# EAGLE design harp input expander (EAGLE 9.5.1)
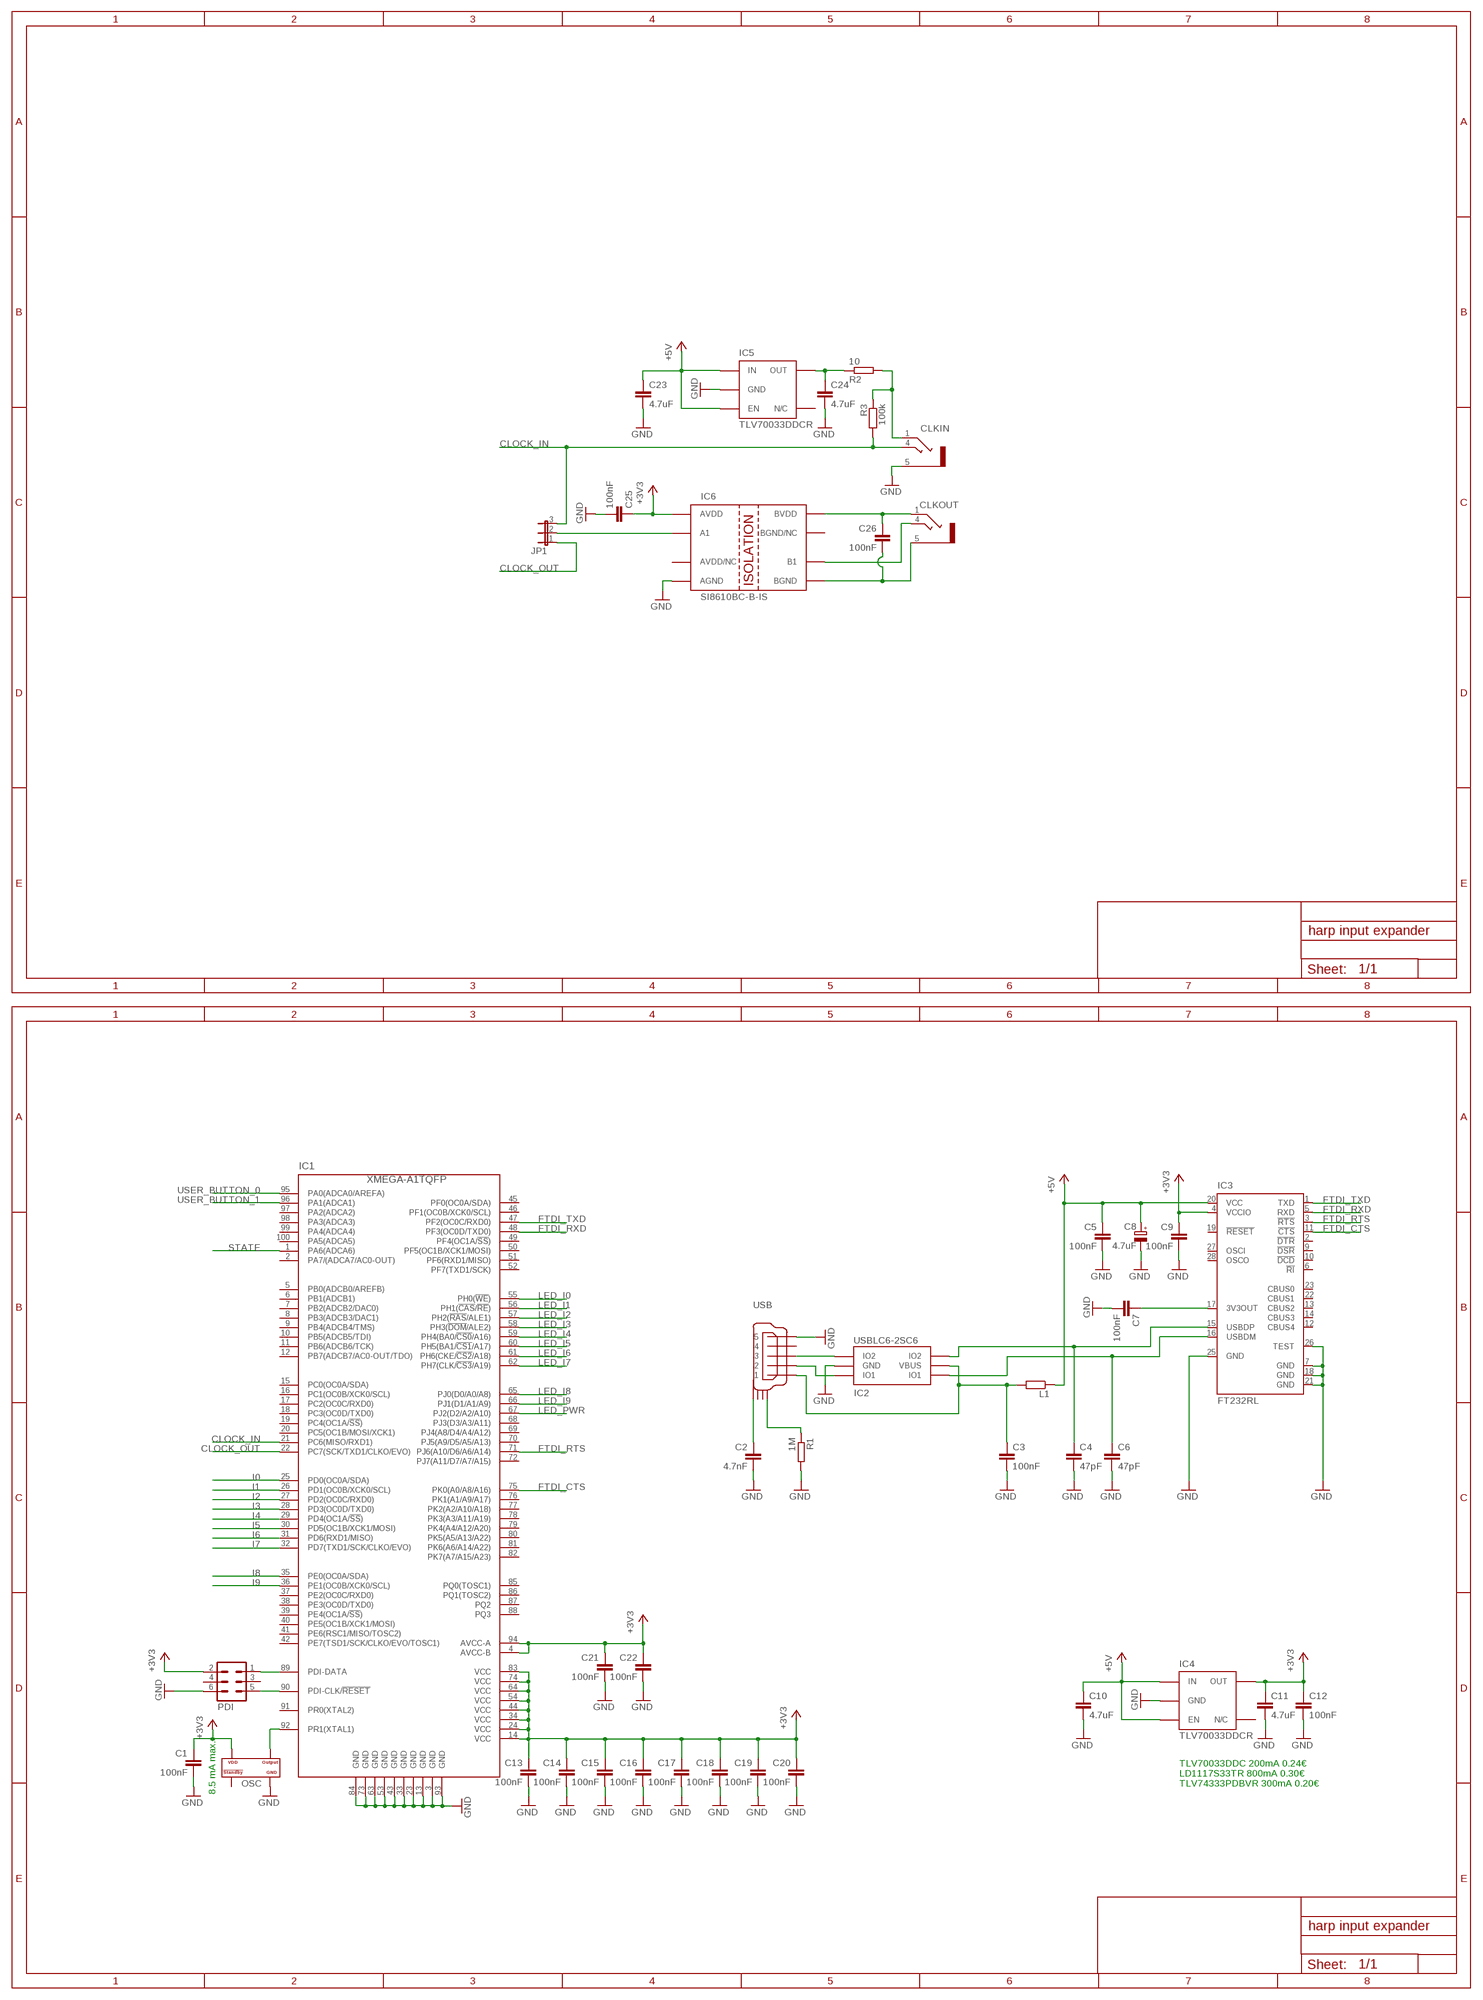
[diagram p0: schematic, sheet 1, part 1 of 2]
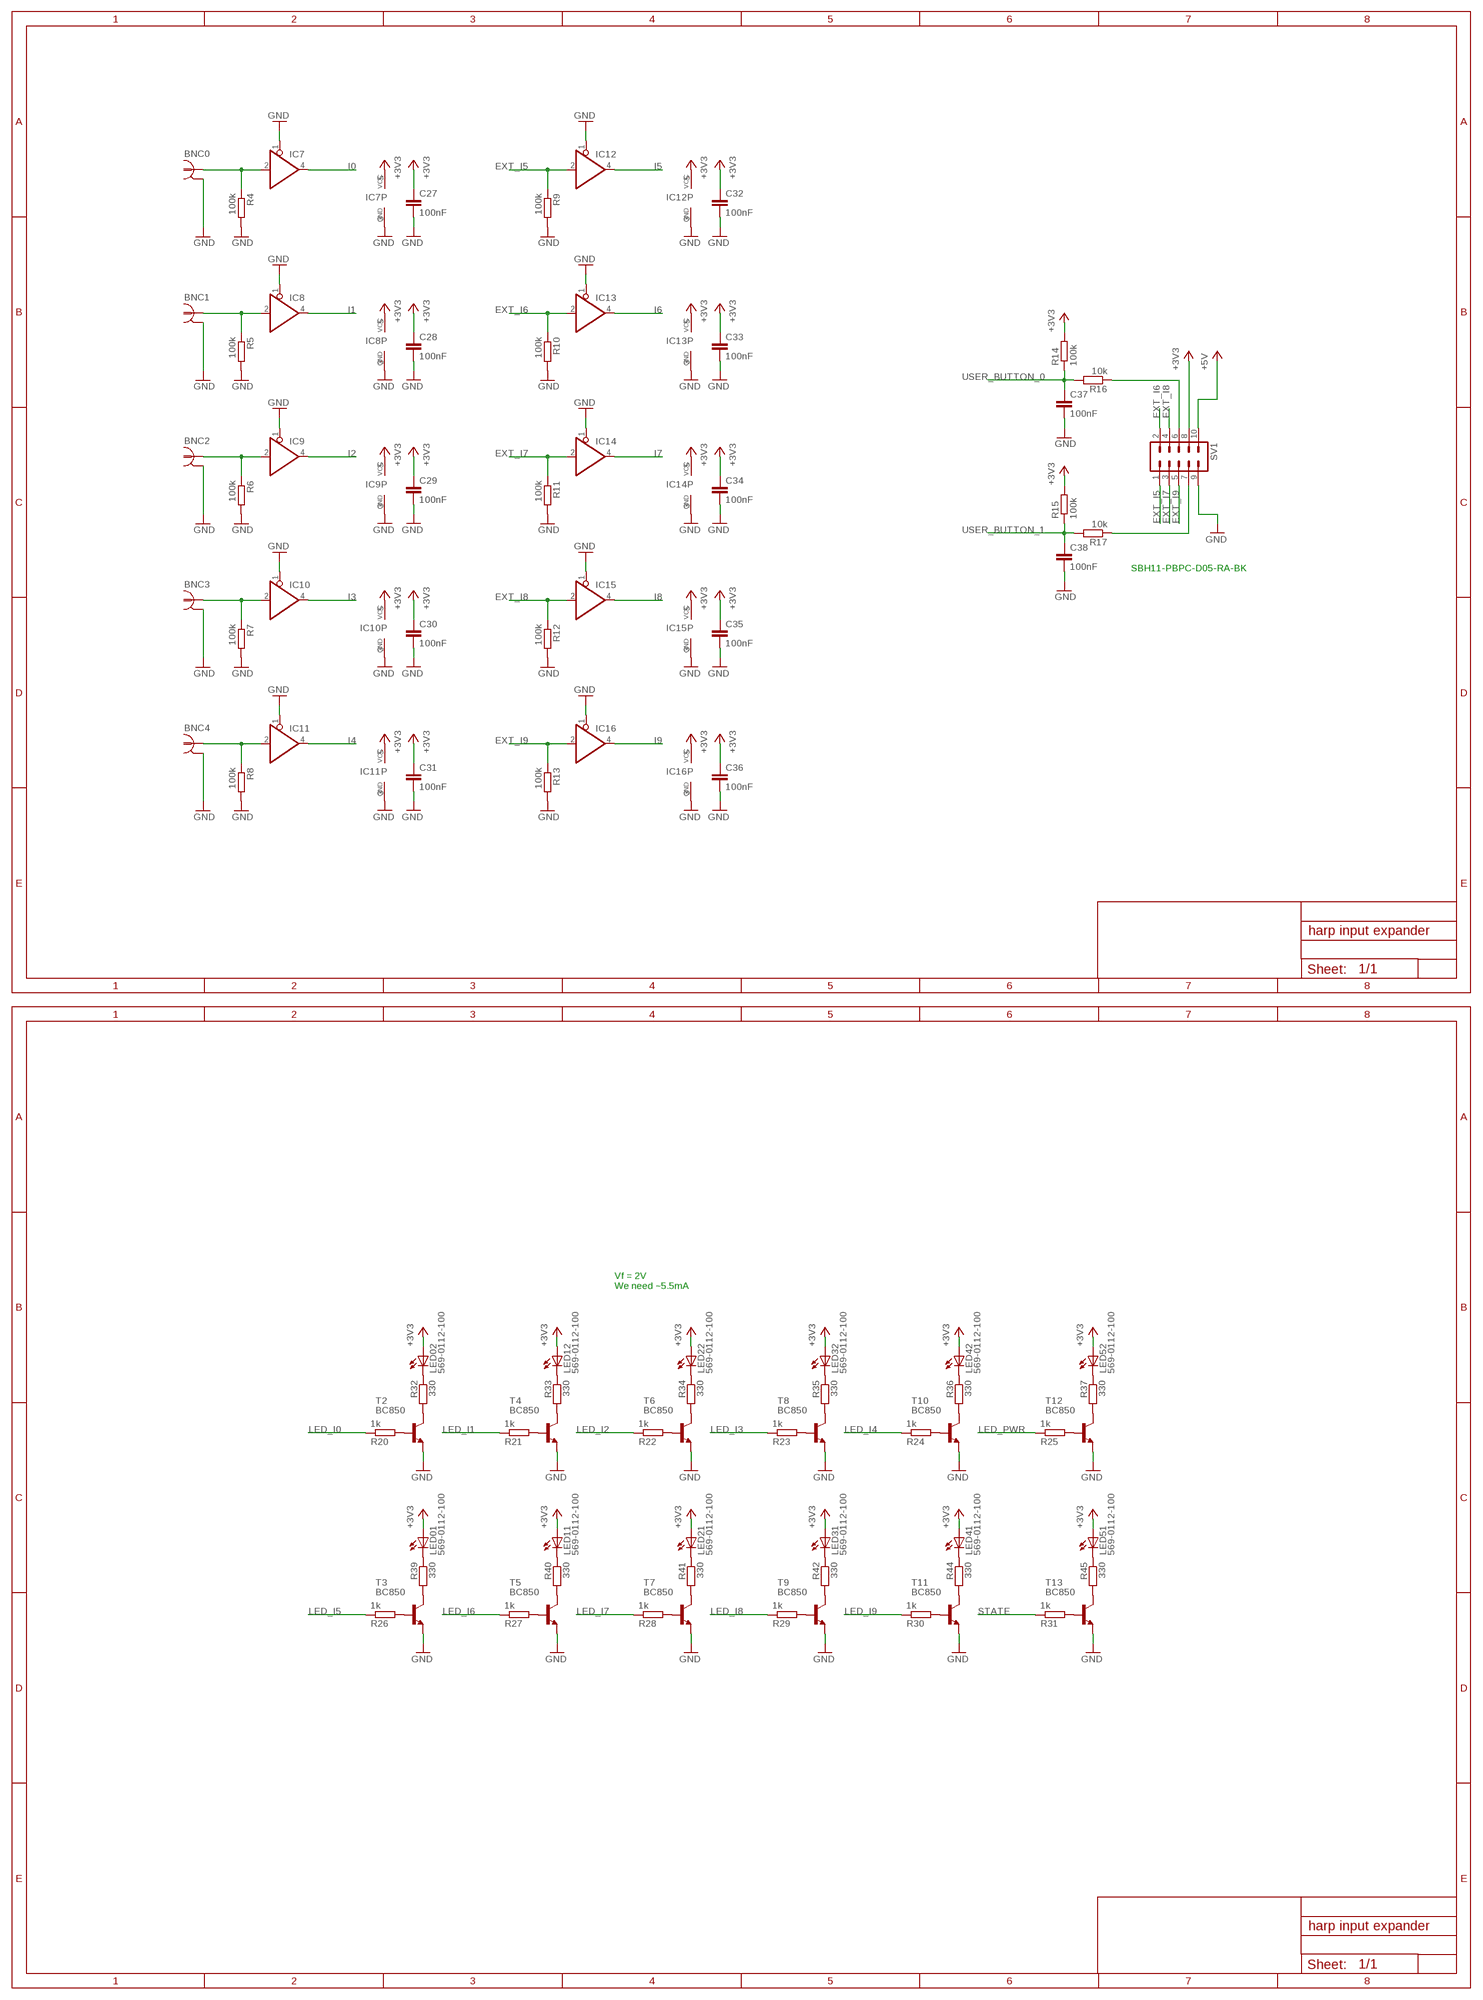
[diagram p1: schematic, sheet 1, part 2 of 2]

## Parts
BNC0  BNC_0731000105  [0731000105]
BNC1  BNC_0731000105  [0731000105]
BNC2  BNC_0731000105  [0731000105]
BNC3  BNC_0731000105  [0731000105]
BNC4  BNC_0731000105  [0731000105]
C1  100nF  C-EUC0402  [C0402]
C2  4.7nF  C-EUC0402  [C0402]
C3  100nF  C-EUC0402  [C0402]
C4  47pF  C-EUC0402  [C0402]
C5  100nF  C-EUC0402  [C0402]
C6  47pF  C-EUC0402  [C0402]
C7  100nF  C-EUC0402  [C0402]
C8  4.7uF  CPOL-EUA/3216-18W  [A/3216-18W]
C9  100nF  C-EUC0402  [C0402]
C10  4.7uF  C-EUC0603  [C0603]
C11  4.7uF  C-EUC0603  [C0603]
C12  100nF  C-EUC0402  [C0402]
C13  100nF  C-EUC0402  [C0402]
C14  100nF  C-EUC0402  [C0402]
C15  100nF  C-EUC0402  [C0402]
C16  100nF  C-EUC0402  [C0402]
C17  100nF  C-EUC0402  [C0402]
C18  100nF  C-EUC0402  [C0402]
C19  100nF  C-EUC0402  [C0402]
C20  100nF  C-EUC0402  [C0402]
C21  100nF  C-EUC0402  [C0402]
C22  100nF  C-EUC0402  [C0402]
C23  4.7uF  C-EUC0603  [C0603]
C24  4.7uF  C-EUC0603  [C0603]
C25  100nF  C-EUC0402  [C0402]
C26  100nF  C-EUC0402  [C0402]
C27  100nF  C-EUC0402  [C0402]
C28  100nF  C-EUC0402  [C0402]
C29  100nF  C-EUC0402  [C0402]
C30  100nF  C-EUC0402  [C0402]
C31  100nF  C-EUC0402  [C0402]
C32  100nF  C-EUC0402  [C0402]
C33  100nF  C-EUC0402  [C0402]
C34  100nF  C-EUC0402  [C0402]
C35  100nF  C-EUC0402  [C0402]
C36  100nF  C-EUC0402  [C0402]
C37  100nF  C-EUC0402  [C0402]
C38  100nF  C-EUC0402  [C0402]
CLKIN  STEREO_JACK  [35RASMT2BHNTRX]
CLKOUT  STEREO_JACK  [35RASMT2BHNTRX]
IC1  XMEGA-A1TQFP  [TQFP100]
IC2  USBLC6-2SC6  USBLC6-2  [SOT23-6L]
IC3  FT232RL  [SSOP28]
IC4  TLV70033DDCR  TLV700XX  [TSOT23-5]
IC5  TLV70033DDCR  TLV700XX  [TSOT23-5]
IC6  SI8610BC-B-IS  SI8610  [SO-08]
IC7  74AHC1G125DBV  [SOT23-5]
IC8  74AHC1G125DBV  [SOT23-5]
IC9  74AHC1G125DBV  [SOT23-5]
IC10  74AHC1G125DBV  [SOT23-5]
IC11  74AHC1G125DBV  [SOT23-5]
IC12  74AHC1G125DBV  [SOT23-5]
IC13  74AHC1G125DBV  [SOT23-5]
IC14  74AHC1G125DBV  [SOT23-5]
IC15  74AHC1G125DBV  [SOT23-5]
IC16  74AHC1G125DBV  [SOT23-5]
JP1  JP2E  [JP2]
L1  ???  R-EU_R0805  [R0805]
LED0  569-0112-100  LED_2X_VERTICAL  [569-011X-X00_LED_ARRAY]
LED1  569-0112-100  LED_2X_VERTICAL  [569-011X-X00_LED_ARRAY]
LED2  569-0112-100  LED_2X_VERTICAL  [569-011X-X00_LED_ARRAY]
LED3  569-0112-100  LED_2X_VERTICAL  [569-011X-X00_LED_ARRAY]
LED4  569-0112-100  LED_2X_VERTICAL  [569-011X-X00_LED_ARRAY]
LED5  569-0112-100  LED_2X_VERTICAL  [569-011X-X00_LED_ARRAY]
OSC  OSCILLATOR  [OSCILLATOR_3.2X2.5]
PDI  MA03-2  [MA03-2]
R1  1M  R-EU_R0402  [R0402]
R2  10  R-EU_R0402  [R0402]
R3  100k  R-EU_R0402  [R0402]
R4  100k  R-EU_R0402  [R0402]
R5  100k  R-EU_R0402  [R0402]
R6  100k  R-EU_R0402  [R0402]
R7  100k  R-EU_R0402  [R0402]
R8  100k  R-EU_R0402  [R0402]
R9  100k  R-EU_R0402  [R0402]
R10  100k  R-EU_R0402  [R0402]
R11  100k  R-EU_R0402  [R0402]
R12  100k  R-EU_R0402  [R0402]
R13  100k  R-EU_R0402  [R0402]
R14  100k  R-EU_R0402  [R0402]
R15  100k  R-EU_R0402  [R0402]
R16  10k  R-EU_R0402  [R0402]
R17  10k  R-EU_R0402  [R0402]
R20  1k  R-EU_R0402  [R0402]
R21  1k  R-EU_R0402  [R0402]
R22  1k  R-EU_R0402  [R0402]
R23  1k  R-EU_R0402  [R0402]
R24  1k  R-EU_R0402  [R0402]
R25  1k  R-EU_R0402  [R0402]
R26  1k  R-EU_R0402  [R0402]
R27  1k  R-EU_R0402  [R0402]
R28  1k  R-EU_R0402  [R0402]
R29  1k  R-EU_R0402  [R0402]
R30  1k  R-EU_R0402  [R0402]
R31  1k  R-EU_R0402  [R0402]
R32  330  R-EU_R0402  [R0402]
R33  330  R-EU_R0402  [R0402]
R34  330  R-EU_R0402  [R0402]
R35  330  R-EU_R0402  [R0402]
R36  330  R-EU_R0402  [R0402]
R37  330  R-EU_R0402  [R0402]
R39  330  R-EU_R0402  [R0402]
R40  330  R-EU_R0402  [R0402]
R41  330  R-EU_R0402  [R0402]
R42  330  R-EU_R0402  [R0402]
R44  330  R-EU_R0402  [R0402]
R45  330  R-EU_R0402  [R0402]
SV1  ML10L  [ML10L]
T2  BC850  [SOT23]
T3  BC850  [SOT23]
T4  BC850  [SOT23]
T5  BC850  [SOT23]
T6  BC850  [SOT23]
T7  BC850  [SOT23]
T8  BC850  [SOT23]
T9  BC850  [SOT23]
T10  BC850  [SOT23]
T11  BC850  [SOT23]
T12  BC850  [SOT23]
T13  BC850  [SOT23]
USB  USB_MINI_B  [240-0002-1]

## Nets
5VUSB: C3.1 IC2.P$5(VBUS) L1.2 USB.P$1
+3V3: C1.1 C9.1 C11.1 C12.1 C13.1 C14.1 C15.1 C16.1 C17.1 C18.1 C19.1 C20.1 C21.1 C22.1 C25.1 C27.1 C28.1 C29.1 C30.1 C31.1 C32.1 C33.1 C34.1 C35.1 C36.1 IC1.4(AVCC-B) IC1.14(VCC) IC1.24(VCC) IC1.34(VCC) IC1.44(VCC) IC1.54(VCC) IC1.64(VCC) IC1.74(VCC) IC1.83(VCC) IC1.94(AVCC-A) IC3.4(VCCIO) IC4.5(OUT) IC6.1(AVDD) IC7.5(VCC) IC8.5(VCC) IC9.5(VCC) IC10.5(VCC) IC11.5(VCC) IC12.5(VCC) IC13.5(VCC) IC14.5(VCC) IC15.5(VCC) IC16.5(VCC) LED0.A1(1:A) LED0.A2(2:A) LED1.A1(1:A) LED1.A2(2:A) LED2.A1(1:A) LED2.A2(2:A) LED3.A1(1:A) LED3.A2(2:A) LED4.A1(1:A) LED4.A2(2:A) LED5.A1(1:A) LED5.A2(2:A) OSC.P$4(VDD) PDI.2 R14.2 R15.2 SV1.8
+5V: C5.1 C8.+ C10.1 C23.1 IC3.20(VCC) IC4.1(IN) IC4.3(EN) IC5.1(IN) IC5.3(EN) L1.1 SV1.10
CLOCK_IN: CLKIN.4 IC1.21(PC6(MISO/RXD1)) JP1.3 R3.2
CLOCK_OUT: IC1.22(PC7(SCK/TXD1/CLKO/EVO)) JP1.1
EXT_I5: IC12.2(I) R9.1 SV1.1
EXT_I6: IC13.2(I) R10.1 SV1.2
EXT_I7: IC14.2(I) R11.1 SV1.3
EXT_I8: IC15.2(I) R12.1 SV1.4
EXT_I9: IC16.2(I) R13.1 SV1.5
FTDI_CTS: IC1.75(PK0(A0/A8/A16)) IC3.11(!CTS)
FTDI_RTS: IC1.71(PJ6(A10/D6/A6/A14)) IC3.3(!RTS)
FTDI_RXD: IC1.48(PF3(OC0D/TXD0)) IC3.5(RXD)
FTDI_TXD: IC1.47(PF2(OC0C/RXD0)) IC3.1(TXD)
GND: BNC0.2 BNC0.3 BNC1.2 BNC1.3 BNC2.2 BNC2.3 BNC3.2 BNC3.3 BNC4.2 BNC4.3 C1.2 C2.2 C3.2 C4.2 C5.2 C6.2 C7.2 C8.- C9.2 C10.2 C11.2 C12.2 C13.2 C14.2 C15.2 C16.2 C17.2 C18.2 C19.2 C20.2 C21.2 C22.2 C23.2 C24.2 C25.2 C27.2 C28.2 C29.2 C30.2 C31.2 C32.2 C33.2 C34.2 C35.2 C36.2 C37.2 C38.2 CLKIN.5 IC1.3(GND) IC1.13(GND) IC1.23(GND) IC1.33(GND) IC1.43(GND) IC1.53(GND) IC1.63(GND) IC1.73(GND) IC1.84(GND) IC1.93(GND) IC2.P$2(GND) IC3.7(GND) IC3.18(GND) IC3.21(GND) IC3.25(GND) IC3.26(TEST) IC4.2(GND) IC5.2(GND) IC6.4(AGND) IC7.1(OE) IC7.3(GND) IC8.1(OE) IC8.3(GND) IC9.1(OE) IC9.3(GND) IC10.1(OE) IC10.3(GND) IC11.1(OE) IC11.3(GND) IC12.1(OE) IC12.3(GND) IC13.1(OE) IC13.3(GND) IC14.1(OE) IC14.3(GND) IC15.1(OE) IC15.3(GND) IC16.1(OE) IC16.3(GND) OSC.P$2(GND) PDI.6 R1.2 R4.2 R5.2 R6.2 R7.2 R8.2 R9.2 R10.2 R11.2 R12.2 R13.2 SV1.9 T2.2(E) T3.2(E) T4.2(E) T5.2(E) T6.2(E) T7.2(E) T8.2(E) T9.2(E) T10.2(E) T11.2(E) T12.2(E) T13.2(E) USB.P$5
GND_ISO: C26.2 CLKOUT.5 IC6.5(BGND)
I0: IC1.25(PD0(OC0A/SDA)) IC7.4(O)
I1: IC1.26(PD1(OC0B/XCK0/SCL)) IC8.4(O)
I2: IC1.27(PD2(OC0C/RXD0)) IC9.4(O)
I3: IC1.28(PD3(OC0D/TXD0)) IC10.4(O)
I4: IC1.29(PD4(OC1A/!SS!)) IC11.4(O)
I5: IC1.30(PD5(OC1B/XCK1/MOSI)) IC12.4(O)
I6: IC1.31(PD6(RXD1/MISO)) IC13.4(O)
I7: IC1.32(PD7(TXD1/SCK/CLKO/EVO)) IC14.4(O)
I8: IC1.35(PE0(OC0A/SDA)) IC15.4(O)
I9: IC1.36(PE1(OC0B/XCK0/SCL)) IC16.4(O)
LED_I0: IC1.55(PH0(!WE!)) R20.1
LED_I1: IC1.56(PH1(!CAS!/!RE!)) R21.1
LED_I2: IC1.57(PH2(!RAS!/ALE1)) R22.1
LED_I3: IC1.58(PH3(!DOM!/ALE2)) R23.1
LED_I4: IC1.59(PH4(BA0/!CS0!/A16)) R24.1
LED_I5: IC1.60(PH5(BA1/!CS1!/A17)) R26.1
LED_I6: IC1.61(PH6(CKE/!CS2!/A18)) R27.1
LED_I7: IC1.62(PH7(CLK/!CS3!/A19)) R28.1
LED_I8: IC1.65(PJ0(D0/A0/A8)) R29.1
LED_I9: IC1.66(PJ1(D1/A1/A9)) R30.1
LED_PWR: IC1.67(PJ2(D2/A2/A10)) R25.1
N$1: R24.2 T10.1(B)
N$2: CLKOUT.4 IC6.6(B1)
N$3: R20.2 T2.1(B)
N$4: LED0.C2(2:C) R32.1
N$5: C26.1 CLKOUT.1 IC6.8(BVDD)
N$6: BNC1.1 IC8.2(I) R5.1
N$7: R36.2 T10.3(C)
N$8: R32.2 T2.3(C)
N$9: BNC2.1 IC9.2(I) R6.1
N$10: BNC3.1 IC10.2(I) R7.1
N$11: BNC4.1 IC11.2(I) R8.1
N$12: BNC0.1 IC7.2(I) R4.1
N$14: R26.2 T3.1(B)
N$15: R22.2 T6.1(B)
N$16: R39.2 T3.3(C)
N$17: R21.2 T4.1(B)
N$18: LED3.C1(1:C) R42.1
N$19: R33.2 T4.3(C)
N$20: R27.2 T5.1(B)
N$21: R34.2 T6.3(C)
N$22: R40.2 T5.3(C)
N$23: LED3.C2(2:C) R35.1
N$24: R28.2 T7.1(B)
N$25: R41.2 T7.3(C)
N$26: R23.2 T8.1(B)
N$27: R35.2 T8.3(C)
N$28: R29.2 T9.1(B)
N$29: R42.2 T9.3(C)
N$30: LED1.C2(2:C) R33.1
N$31: LED2.C2(2:C) R34.1
N$32: LED1.C1(1:C) R40.1
N$33: LED2.C1(1:C) R41.1
N$34: R30.2 T11.1(B)
N$36: LED0.C1(1:C) R39.1
N$38: C7.1 IC3.17(3V3OUT)
N$40: IC2.P$1(IO1) USB.P$2
N$41: CLKIN.1 R2.2 R3.1
N$42: C24.1 IC5.5(OUT) R2.1
N$43: IC6.2(A1) JP1.2
N$45: R16.1 SV1.6
N$46: R17.1 SV1.7
N$47: R44.2 T11.3(C)
N$50: IC2.P$3(IO2) USB.P$3
N$53: R25.2 T12.1(B)
N$54: R37.2 T12.3(C)
N$56: R31.2 T13.1(B)
N$59: C2.1 USB.SHIELD_4
N$60: R45.2 T13.3(C)
N$61: R1.1 USB.SHIELD_1
N$62: LED5.C1(1:C) R45.1
N$63: LED5.C2(2:C) R37.1
N$65: LED4.C2(2:C) R36.1
N$66: LED4.C1(1:C) R44.1
OSC1: IC1.92(PR1(XTAL1)) OSC.P$3(OUTPUT)
PDI_CLK: IC1.90(PDI-CLK/!RESET) PDI.5
PDI_DATA: IC1.89(PDI-DATA) PDI.1
STATE: IC1.1(PA6(ADCA6)) R31.1
USBDM: C6.1 IC2.P$6(IO1) IC3.16(USBDM)
USBDP: C4.1 IC2.P$4(IO2) IC3.15(USBDP)
USER_BUTTON_0: C37.1 IC1.95(PA0(ADCA0/AREFA)) R14.1 R16.2
USER_BUTTON_1: C38.1 IC1.96(PA1(ADCA1)) R15.1 R17.2
Unconnected: IC1.2(PA7/(ADCA7/AC0-OUT)) IC1.5(PB0(ADCB0/AREFB)) IC1.6(PB1(ADCB1)) IC1.7(PB2(ADCB2/DAC0)) IC1.8(PB3(ADCB3/DAC1)) IC1.9(PB4(ADCB4/TMS)) IC1.10(PB5(ADCB5/TDI)) IC1.11(PB6(ADCB6/TCK)) IC1.12(PB7(ADCB7/AC0-OUT/TDO)) IC1.15(PC0(OC0A/SDA)) IC1.16(PC1(OC0B/XCK0/SCL)) IC1.17(PC2(OC0C/RXD0)) IC1.18(PC3(OC0D/TXD0)) IC1.19(PC4(OC1A/!SS!)) IC1.20(PC5(OC1B/MOSI/XCK1)) IC1.37(PE2(OC0C/RXD0)) IC1.38(PE3(OC0D/TXD0)) IC1.39(PE4(OC1A/!SS!)) IC1.40(PE5(OC1B/XCK1/MOSI)) IC1.41(PE6(RSC1/MISO/TOSC2)) IC1.42(PE7(TSD1/SCK/CLKO/EVO/TOSC1)) IC1.45(PF0(OC0A/SDA)) IC1.46(PF1(OC0B/XCK0/SCL)) IC1.49(PF4(OC1A/!SS!)) IC1.50(PF5(OC1B/XCK1/MOSI)) IC1.51(PF6(RXD1/MISO)) IC1.52(PF7(TXD1/SCK)) IC1.68(PJ3(D3/A3/A11)) IC1.69(PJ4(A8/D4/A4/A12)) IC1.70(PJ5(A9/D5/A5/A13)) IC1.72(PJ7(A11/D7/A7/A15)) IC1.76(PK1(A1/A9/A17)) IC1.77(PK2(A2/A10/A18)) IC1.78(PK3(A3/A11/A19)) IC1.79(PK4(A4/A12/A20)) IC1.80(PK5(A5/A13/A22)) IC1.81(PK6(A6/A14/A22)) IC1.82(PK7(A7/A15/A23)) IC1.85(PQ0(TOSC1)) IC1.86(PQ1(TOSC2)) IC1.87(PQ2) IC1.88(PQ3) IC1.91(PR0(XTAL2)) IC1.97(PA2(ADCA2)) IC1.98(PA3(ADCA3)) IC1.99(PA4(ADCA4)) IC1.100(PA5(ADCA5)) IC3.2(!DTR) IC3.6(!RI) IC3.9(!DSR) IC3.10(!DCD) IC3.12(CBUS4) IC3.13(CBUS2) IC3.14(CBUS3) IC3.19(!RESET) IC3.22(CBUS1) IC3.23(CBUS0) IC3.27(OSCI) IC3.28(OSCO) IC4.4(N/C) IC5.4(N/C) IC6.3(AVDD/NC) IC6.7(BGND/NC) OSC.P$1(STANDBY#) PDI.3 PDI.4 USB.P$4 USB.SHIELD_2 USB.SHIELD_3

## Notes on the sheet
- SBH11-PBPC-D05-RA-BK
- Vf = 2V
  We need ~5.5mA
- TLV70033DDC 200mA 0.24€
  LD1117S33TR 800mA 0.30€
  TLV74333PDBVR 300mA 0.20€
- 8.5 mA max.

## Library data of the parts
BNC0 BNC1-BNC4 = jonnew:BNC: BNC CONNECTOR M/A COM www.macom.com distributor Farnell 149-452
C1-C7 C9-C38 = rcl:C-EU: CAPACITOR, European symbol
C8 = rcl:CPOL-EU: POLARIZED CAPACITOR, European symbol
CLKIN CLKOUT = CNP-connectors:STEREO_JACK
IC1 = avr-7:XMEGA-A1: Atmel XMega A1 Series processor
IC2 = CNP 2:USBLC6-2
IC3 = ftdichip:FT232R: Source: http://www.ftdichip.com/Documents/DataSheets/DS_FT232R_v104.pdf; MPN: FT232RL; OC_FARNELL: 1146032; OC_NEWARK: 91K9918
IC4 IC5 = CNP:TLV700XX
IC6 = CNP-ics 2:SI8610
IC7-IC16 = 74xx-little-de:74*1G125: Single Bus Buffer Gate with 3-State Output
JP1 = jumper:JP2E: JUMPER
L1 R1-R17 R20-R37 R39-R42 R44 R45 = rcl:R-EU_: RESISTOR, European symbol
LED0 LED1-LED5 = jonnew:LED_2X
OSC = CNP-miscellaneous:OSCILLATOR
PDI = con-lstb:MA03-2: PIN HEADER; OC_FARNELL: unknown; OC_NEWARK: unknown
SV1 = con-ml:ML10L: HARTING; OC_FARNELL: unknown; OC_NEWARK: unknown
T2-T13 = transistor:BC850: NPN TRANSISTOR
USB = CNP-connectors:USB_MINI_B

## Board
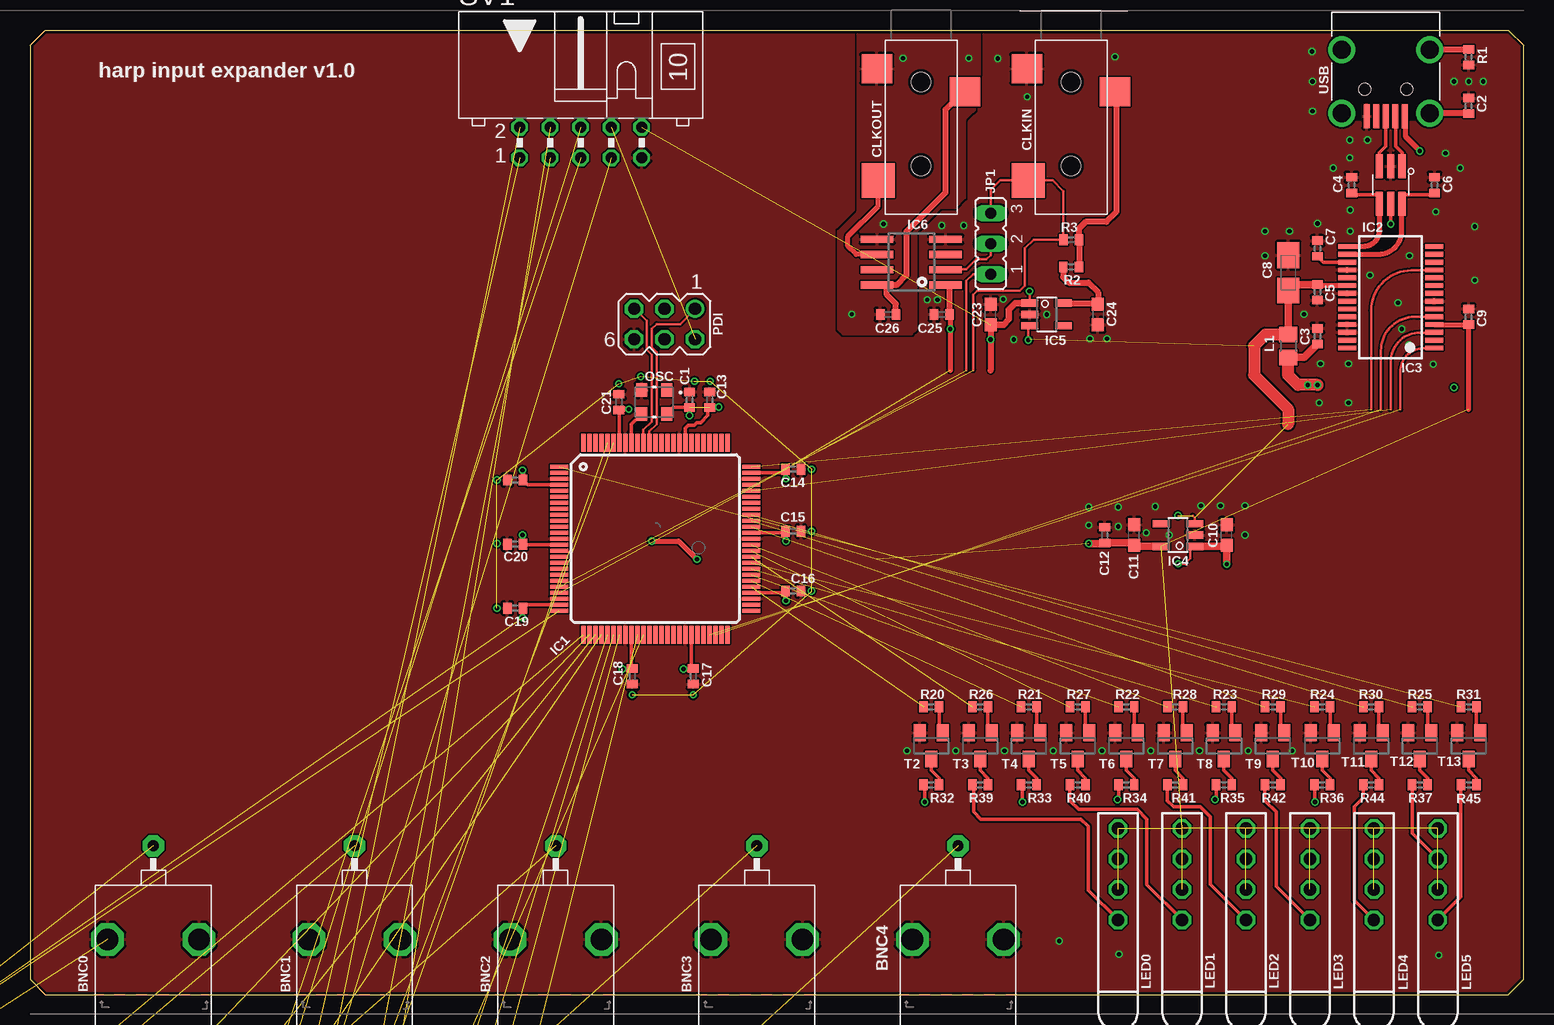
[diagram p2: board, top side]
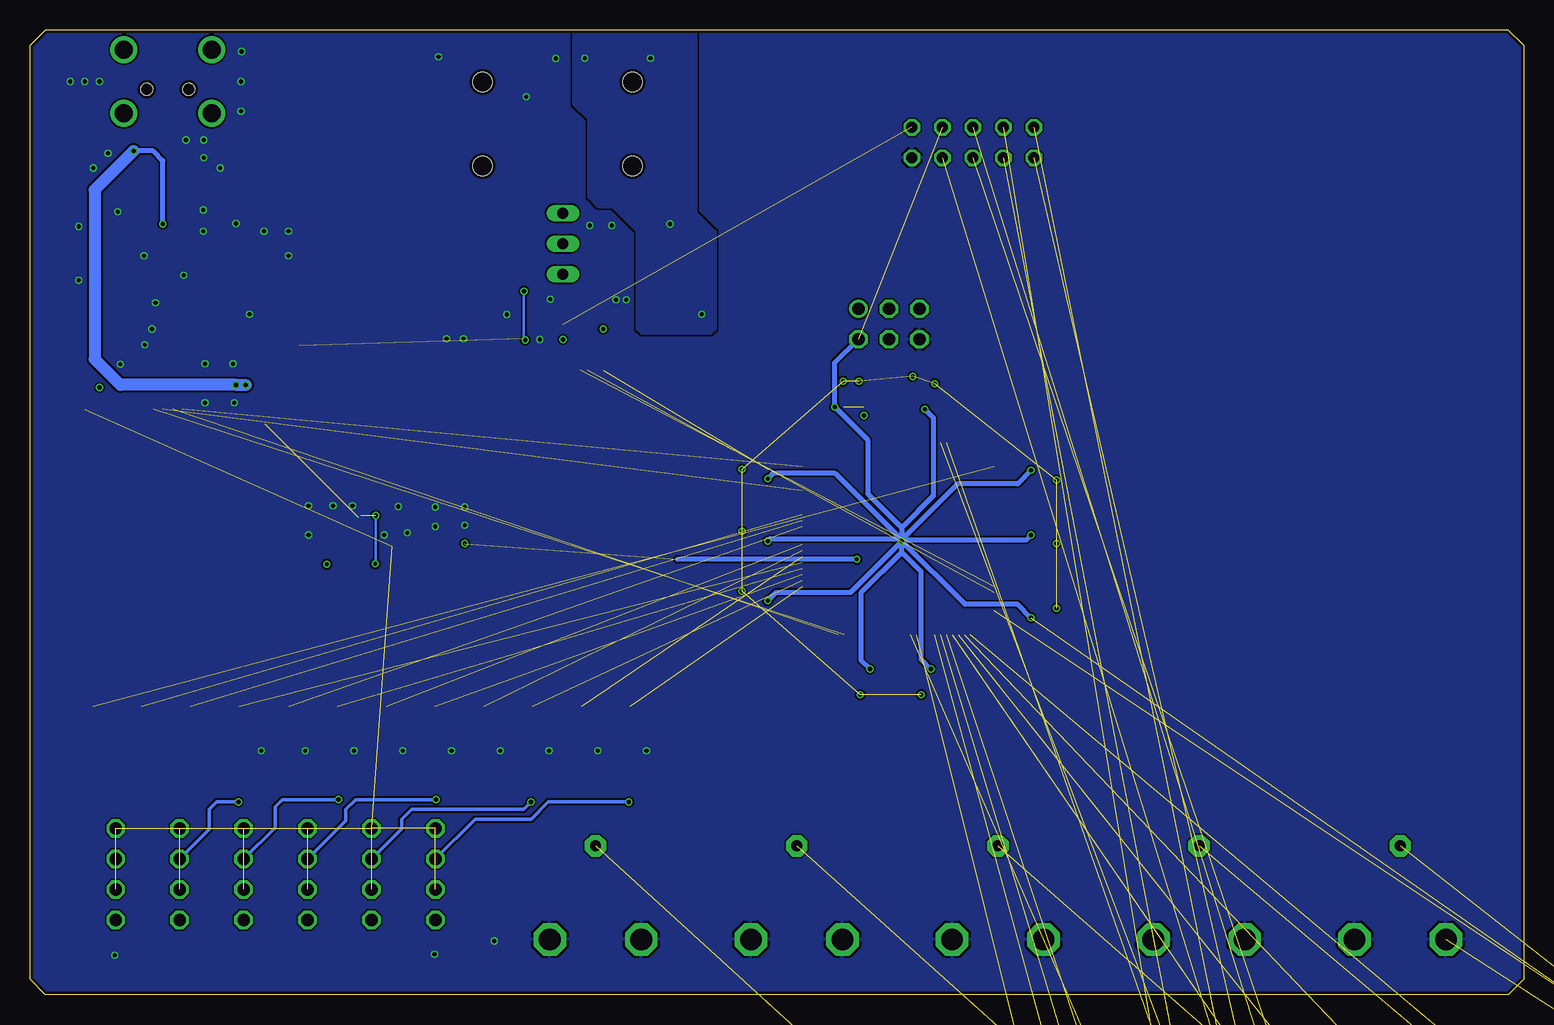
[diagram p3: board, bottom side, seen from below]

Size 124.46 x 80.38 mm. Coordinates in mm from the lower left corner, seen from the top.
Outline: 0,79.11 0,1.27 1.27,0 123.19,0 124.46,1.27 124.46,79.11 123.19,80.38 1.27,80.38 0,79.11
Copper layers (1*16): Top 0.018mm / dielectric 0.36mm / Bottom 0.018mm
Design rules "eC_4Layer_PClass6_BaseCopperO18-I35_eCDefault *": minimum track width 0.15mm, minimum drill 0.35mm, track to track 0.15mm, track to pad 0.15mm, pad to pad 0.15mm, via to via 0.15mm, smd to smd 0mil, copper to edge 0.25mm, drill to drill 0.35mm, minimum pad ring 0.175mm, minimum via ring 0.125mm, stop-mask expansion 0mil, vias tented up to drill 0.45mm, thermal gap 0.2mm
tKeepout: area 0,0.5 to 2.5,80.5; area 122.4,0.5 to 125,80.5
bKeepout: area 122.4,0.5 to 125,80.5

### Footprints (pad centres in the part's own frame; a part is rotated, then mirrored left to right if it is on the bottom)
0731000105 = drill 0.914 pad 1.778 octagon: 1 0,12.395 | drill 1.803 octagon: 2 -3.81,4.597; 3 3.81,4.597
C0402 = smd 0.7 x 0.9: 1 -0.65,0; 2 0.65,0
A/3216-18W = smd 2.15 x 1.8: + 1.475,0; - -1.475,0
C0603 = smd 1.1 x 1: 1 -0.85,0; 2 0.85,0
35RASMT2BHNTRX = smd 2.4 x 2.55: 1 0.8,3.675; 5 -1.1,-3.675 | smd 2.9 x 2.75: 4 8.2,-3.575 | hole 1.6: 0,0; 7,0
TQFP100 = smd 1.5 x 0.35: 1 -8,6; 2 -8,5.5; 3 -8,5; 4 -8,4.5; 5 -8,4; 6 -8,3.5; 7 -8,3; 8 -8,2.5; 9 -8,2; 10 -8,1.5; 11 -8,1; 12 -8,0.5; 13 -8,0; 14 -8,-0.5; 15 -8,-1; 16 -8,-1.5; 17 -8,-2; 18 -8,-2.5; 19 -8,-3; 20 -8,-3.5; 21 -8,-4; 22 -8,-4.5; 23 -8,-5; 24 -8,-5.5; 25 -8,-6; 51 8,-6; 52 8,-5.5; 53 8,-5; 54 8,-4.5; 55 8,-4; 56 8,-3.5; 57 8,-3; 58 8,-2.5; 59 8,-2; 60 8,-1.5; 61 8,-1; 62 8,-0.5; 63 8,0; 64 8,0.5; 65 8,1; 66 8,1.5; 67 8,2; 68 8,2.5; 69 8,3; 70 8,3.5; 71 8,4; 72 8,4.5; 73 8,5; 74 8,5.5; 75 8,6 | smd 0.35 x 1.5: 26 -6,-8; 27 -5.5,-8; 28 -5,-8; 29 -4.5,-8; 30 -4,-8; 31 -3.5,-8; 32 -3,-8; 33 -2.5,-8; 34 -2,-8; 35 -1.5,-8; 36 -1,-8; 37 -0.5,-8; 38 0,-8; 39 0.5,-8; 40 1,-8; 41 1.5,-8; 42 2,-8; 43 2.5,-8; 44 3,-8; 45 3.5,-8; 46 4,-8; 47 4.5,-8; 48 5,-8; 49 5.5,-8; 50 6,-8; 76 6,8; 77 5.5,8; 78 5,8; 79 4.5,8; 80 4,8; 81 3.5,8; 82 3,8; 83 2.5,8; 84 2,8; 85 1.5,8; 86 1,8; 87 0.5,8; 88 0,8; 89 -0.5,8; 90 -1,8; 91 -1.5,8; 92 -2,8; 93 -2.5,8; 94 -3,8; 95 -3.5,8; 96 -4,8; 97 -4.5,8; 98 -5,8; 99 -5.5,8; 100 -6,8
SOT23-6L = smd 0.6 x 2: P$1 -0.95,-1.55; P$2 0,-1.55; P$3 0.95,-1.55; P$4 0.95,1.55; P$5 0,1.55; P$6 -0.95,1.55
SSOP28 = smd 0.4 x 1.5: 1 -4.225,-3.625; 2 -3.575,-3.625; 3 -2.925,-3.625; 4 -2.275,-3.625; 5 -1.625,-3.625; 6 -0.975,-3.625; 7 -0.325,-3.625; 8 0.325,-3.625; 9 0.975,-3.625; 10 1.625,-3.625; 11 2.275,-3.625; 12 2.925,-3.625; 13 3.575,-3.625; 14 4.225,-3.625; 15 4.225,3.625; 16 3.575,3.625; 17 2.925,3.625; 18 2.275,3.625; 19 1.625,3.625; 20 0.975,3.625; 21 0.325,3.625; 22 -0.325,3.625; 23 -0.975,3.625; 24 -1.625,3.625; 25 -2.275,3.625; 26 -2.925,3.625; 27 -3.575,3.625; 28 -4.225,3.625
TSOT23-5 = smd 0.6 x 1.408: 1 -0.95,-1.404; 2 0,-1.404; 3 0.95,-1.404; 4 0.95,1.404; 5 -0.95,1.404
SO-08 = smd 0.6 x 2.708: 1 -1.905,-2.854; 2 -0.635,-2.854; 3 0.635,-2.854; 4 1.905,-2.854; 5 1.905,2.854; 6 0.635,2.854; 7 -0.635,2.854; 8 -1.905,2.854
SOT23-5 = smd 0.69 x 0.99: 1 -0.95,-1.29; 2 0,-1.29; 3 0.95,-1.29; 4 0.95,1.3; 5 -0.95,1.3
JP2 = drill 0.914 long: 1 -2.54,0; 2 0,0; 3 2.54,0
R0805 = smd 1.3 x 1.5: 1 -0.95,0; 2 0.95,0
569-011X-X00_LED_ARRAY = drill 1.016 octagon: A1 -6.35,0; A2 -1.27,0; C1 -8.89,0; C2 -3.81,0
OSCILLATOR_3.2X2.5 = smd 0.9 x 1.1: P$1 -1.05,-1; P$2 1.05,-1; P$3 1.05,1; P$4 -1.05,1
MA03-2 = drill 1.016: 1 -2.54,-1.27 | drill 1.016 octagon: 2 -2.54,1.27; 3 0,-1.27; 4 0,1.27; 5 2.54,-1.27; 6 2.54,1.27
R0402 = smd 0.7 x 0.9: 1 -0.65,0; 2 0.65,0
ML10L = drill 0.914 octagon: 1 -5.08,-1.27; 2 -5.08,1.27; 3 -2.54,-1.27; 4 -2.54,1.27; 5 0,-1.27; 6 0,1.27; 7 2.54,-1.27; 8 2.54,1.27; 9 5.08,-1.27; 10 5.08,1.27
SOT23 = smd 1 x 1.4: 1 -0.95,-1.1; 2 0.95,-1.1; 3 0,1.1
240-0002-1 = smd 0.5 x 2: P$1 -1.6,8.65; P$2 -0.8,8.65; P$3 0,8.65; P$4 0.8,8.65; P$5 1.6,8.65 | drill 1.5: SHIELD_1 -3.65,3.1; SHIELD_2 3.65,3.1; SHIELD_3 3.65,8.4; SHIELD_4 -3.65,8.4 | hole 1: -1.75,6.4; 1.75,6.4

### Placement (x,y rotation side)
BNC0  10.28,0 0 top
BNC1  27.04,0 0 top
BNC2  43.81,0 0 top
BNC3  60.57,0 0 top
BNC4  77.33,0 0 top
C1  54.97,49.58 90 top
C2  119.89,74.06 90 top
C3  107.29,54.86 90 top
C4  110.13,67.46 90 top
C5  107.29,58.52 270 top
C6  117.04,67.46 90 top
C7  107.29,62.18 90 top
C8  104.85,60.15 270 top
C9  119.89,56.49 90 top
C10  99.72,38.29 90 top
C11  92,38.29 90 top
C12  89.56,38.29 90 top
C13  56.64,49.58 90 top
C14  63.6,43.79 0 top
C15  63.6,38.61 0 top
C16  63.6,33.63 0 top
C17  55.27,26.52 270 top
C18  50.19,26.52 270 top
C19  40.44,32.21 180 top
C20  40.44,37.54 180 top
C21  49.07,49.38 90 top
C22  40.44,42.88 180 top
C23  80.05,56.68 90 top
C24  88.99,56.68 270 top
C25  75.98,56.68 180 top
C26  71.51,56.68 180 top
C27  -28.45,-17.48 0 top  (outside the outline)
C28  -28.45,-34.14 0 top  (outside the outline)
C29  -28.45,-50.8 0 top  (outside the outline)
C30  -28.45,-67.46 0 top  (outside the outline)
C31  -28.45,-84.12 0 top  (outside the outline)
C32  -28.45,-157.68 0 top  (outside the outline)
C33  -21.95,-157.68 0 top  (outside the outline)
C34  -15.44,-157.68 0 top  (outside the outline)
C35  -8.94,-157.68 0 top  (outside the outline)
C36  -2.44,-157.68 0 top  (outside the outline)
C37  -33.73,-174.35 0 top  (outside the outline)
C38  -33.73,-188.98 0 top  (outside the outline)
CLKIN  86.75,76.05 270 top
CLKOUT  74.25,76.05 270 top
IC1  52.12,38 0 top
IC2  113.39,67.46 180 top
IC3  113.39,58.12 90 top
IC4  95.66,38.29 90 top
IC5  84.72,56.68 270 top
IC6  73.44,61.05 90 top
IC7  -32.11,-19.51 0 top  (outside the outline)
IC8  -32.11,-36.17 0 top  (outside the outline)
IC9  -32.11,-52.83 0 top  (outside the outline)
IC10  -32.11,-69.49 0 top  (outside the outline)
IC11  -32.11,-86.16 0 top  (outside the outline)
IC12  -6.1,-131.27 0 top  (outside the outline)
IC13  -0.81,-131.27 0 top  (outside the outline)
IC14  4.47,-131.27 0 top  (outside the outline)
IC15  9.75,-131.27 0 top  (outside the outline)
IC16  -32.11,-159.72 0 top  (outside the outline)
JP1  80.06,62.59 90 top
L1  104.85,54.05 270 top
LED0  90.67,15.11 90 top
LED1  96,15.11 90 top
LED2  101.33,15.11 90 top
LED3  106.66,15.11 90 top
LED4  111.99,15.11 90 top
LED5  117.32,15.11 90 top
OSC  52.02,49.38 180 top
PDI  52.88,55.88 180 top
R1  119.89,78.12 270 top
R2  86.75,60.64 0 top
R3  86.78,62.91 180 top
R4  -33.73,-29.26 0 top  (outside the outline)
R5  -33.73,-41.05 0 top  (outside the outline)
R6  -33.73,-57.71 0 top  (outside the outline)
R7  -33.73,-74.37 0 top  (outside the outline)
R8  -33.73,-91.03 0 top  (outside the outline)
R9  4.06,-157.68 0 top  (outside the outline)
R10  -28.45,-164.59 0 top  (outside the outline)
R11  -12.6,-164.59 0 top  (outside the outline)
R12  3.25,-164.59 0 top  (outside the outline)
R13  -28.45,-169.47 0 top  (outside the outline)
R14  -33.73,-179.22 0 top  (outside the outline)
R15  -33.73,-193.85 0 top  (outside the outline)
R16  -33.73,-184.1 0 top  (outside the outline)
R17  -33.73,-198.73 0 top  (outside the outline)
R20  75.11,23.98 0 top
R21  83.24,23.98 0 top
R22  91.37,23.98 0 top
R23  99.5,23.98 0 top
R24  107.7,23.98 0 top
R25  115.82,23.98 0 top
R26  79.18,23.98 0 top
R27  87.3,23.98 0 top
R28  95.43,23.98 0 top
R29  103.56,23.98 0 top
R30  111.76,23.98 0 top
R31  119.89,23.98 0 top
R32  75.11,17.48 0 top
R33  83.24,17.48 0 top
R34  91.37,17.48 0 top
R35  99.5,17.48 0 top
R36  107.7,17.48 0 top
R37  115.82,17.48 0 top
R39  79.18,17.48 0 top
R40  87.3,17.48 0 top
R41  95.43,17.48 0 top
R42  103.56,17.48 0 top
R44  111.76,17.48 0 top
R45  119.89,17.48 0 top
SV1  45.89,71 0 top
T2  75.11,20.73 180 top
T3  79.18,20.73 180 top
T4  83.24,20.73 180 top
T5  87.3,20.73 180 top
T6  91.37,20.73 180 top
T7  95.43,20.73 180 top
T8  99.5,20.73 180 top
T9  103.56,20.73 180 top
T10  107.7,20.73 180 top
T11  111.76,20.73 180 top
T12  115.82,20.73 180 top
T13  119.89,20.73 180 top
USB  112.98,81.85 180 top

### Tracks (layer width: path | path; a pad name or v marks a point on that pad's centre or on a via)
5VUSB  (via drill 0.35)
  Top 0.305: IC2.P$5 v113.39,64.21
  Top 0.406: USB.P$1 114.61,72.67 114.61,71.53 v115.82,70.31
  Top 0.61: C3.1 106.18,53.1 L1.2
  Top 1.016: v107.29,50.8 105.66,50.8 104.85,51.61 L1.2
  Bottom 0.406: v113.39,64.21 113.39,69.49 114.2,70.31 v115.82,70.31
  Bottom 1.016: v115.82,70.31 119.08,67.06 119.08,52.96 116.92,50.8 v107.29,50.8 v106.48,50.8
+3V3  (via drill 0.35)  (39 unrouted)
  Top 0.305: IC1.4 41.46,42.5 C22.1 | IC1.14 41.13,37.5 C20.1 | IC1.24 41.38,32.5 C19.1 | IC1.94 49.12,48.68 C21.1 49.11,48.77 | OSC.P$4 53.62,48.93 C1.1 | C13.1 56.49,48.78 56.49,48.26 55.88,47.65 55.58,47.65 55.37,47.45 54.86,47.45 54.62,47.2 IC1.83 | IC1.34 50.12,27.24 C18.1 | IC1.44 55.12,27.32 C17.1 | IC1.54 62.82,33.5 C16.1 | IC1.64 62.84,38.5 C15.1 | IC1.74 62.66,43.5 C14.1
  Top 0.406: IC3.4 119.81,55.84 arc90 C9.1 119.89,48.77 | 76.7,56.62 arc90 C25.1 arc90 76.7,56.62 | 76.7,52.02 v76.7,55.46 76.7,56.62 | v41.05,31.39 41.05,32.17 C19.1 | C20.1 41.05,37.58 v41.05,38.3 | v41.05,43.69 41.05,42.92 C22.1 | v49.89,48.77 49.11,48.77 | C13.1 56.68,48.97 v57.4,48.97 | v62.99,42.98 62.99,43.75 C14.1 | v62.99,37.8 62.99,38.57 C15.1 | v62.99,32.82 62.99,33.33 62.82,33.5 | v49.38,27.13 50.15,27.13 C18.1 | v54.46,27.13 55.23,27.13 C17.1 | v54.97,48.26 C1.1 | v51.82,37.8 54.05,37.8 v55.58,36.27
  Top 0.508: C25.1 76.63,59.14 IC6.1
  Top 0.61: IC4.5 92.1,37.34 C11.1 91.8,37.65 C12.1 89.42,37.65 89.36,37.58 v88.24,37.58
  Bottom 0.406: v41.05,38.3 41.45,37.9 51.71,37.9 51.82,37.9 47.14,42.57 42.16,42.57 v41.05,43.69 | v41.05,31.39 42.16,32.51 46.53,32.51 v51.82,37.8 | v49.38,27.13 50.19,27.94 50.19,35.26 51.82,36.88 | v54.46,27.13 55.17,27.84 55.17,33.53 51.82,36.88 | v62.99,32.82 62.28,33.53 56.08,33.53 v51.82,37.8 | v62.99,37.8 62.79,38 52.02,38 | v62.99,42.98 62.48,43.48 57.4,43.48 51.92,38 52.02,38 | v49.89,48.77 49.17,48.06 49.17,41.55 51.82,38.91 | 51.82,36.88 v51.82,37.8 | 52.02,38 v51.82,37.8 | 51.82,38.91 54.66,41.76 54.66,46.23 v57.4,48.97 57.4,52.68 PDI.2 | 51.82,38.91 v51.82,37.8 | v55.58,36.27 70.51,36.27
  Bottom 0.61: 51.71,37.9 v51.82,37.8
+5V  (via drill 0.35)  (4 unrouted)
  Top 0.203: IC4.3 97.06,39.74 96.88,39.92 | IC5.1 83.32,58.49 v83.3,58.61 | v83.2,54.54 83.2,55.73 IC5.3 | v95.68,35.9 96.24,35.9 96.69,36.36 96.69,37.34 IC4.1
  Top 0.406: IC3.20 107.29,59.09 C5.1 | 105.35,59.17 C8.+
  Top 0.508: 80.06,52.02 80.06,54.58 arc90 v80.05,54.59 C23.1
  Top 0.559: C23.1 81.13,55.83 81.57,56.27 81.57,57.08 82.12,57.63 IC5.1
  Top 0.61: C5.1 105.35,59.17 | L1.1 C8.+ | IC4.1 99.62,37.34 C10.1 v99.72,35.86
  Top 1.016: L1.1 102.96,55 102.01,54.05 102.01,51.61 104.85,48.77 104.85,47.55
  Bottom 0.203: v83.3,58.61 83.3,54.65 v83.2,54.54 | v95.66,39.92 95.66,35.92 v95.68,35.9
CLOCK_IN  (1 unrouted)
  Top 0.203: JP1.3 80.06,67.06 80.85,67.85 CLKIN.4 85.21,67.85 86.11,66.95 86.11,62.93 R3.2 83.63,62.91 82.91,62.18 82.91,59.08 82.5,58.67 78.94,58.67 78.59,58.32 78.59,52.02
CLOCK_OUT  (1 unrouted)
  Top 0.203: JP1.1 78.59,60.05 78.03,59.49 78.03,52.02
EXT_I5  (2 unrouted)
EXT_I6  (2 unrouted)
EXT_I7  (2 unrouted)
EXT_I8  (2 unrouted)
EXT_I9  (2 unrouted)
FTDI_CTS  (1 unrouted)
  Top 0.203: IC3.11 arc-90 116.97,60.35 115.11,60.35 arc90 111.76,57 111.76,48.77
FTDI_RTS  (1 unrouted)
  Top 0.203: IC3.3 arc-90 116.99,55.17 115.82,55.17 arc90 113.39,52.73 113.39,48.77
FTDI_RXD  (1 unrouted)
  Top 0.203: IC3.5 arc-90 IC3.5 115.42,56.49 arc90 112.57,53.65 112.57,48.77
FTDI_TXD  (1 unrouted)
  Top 0.203: IC3.1 arc-90 116.97,53.85 116.13,53.85 arc90 114.2,51.92 114.2,48.77
GND  (via drill 0.35)  (42 unrouted)
  other vias: 81.98,54.59 81.12,57.95 89.75,54.65 88.33,54.65 84.72,56.68 77.81,64.09 75.98,64.09 74.77,57.9 75.63,57.9 83.1,74.81 80.66,78.01 90.41,78.17 77.14,20.32 73.08,20.32 81.21,20.32 85.27,20.32 89.34,20.32 93.4,20.32 97.46,20.32 101.53,20.32 105.19,20.32 85.77,4.47 90.75,3.35 117.39,3.27 101.25,38.29 101.25,40.73 99.21,40.73 97.59,40.73 94.95,38.29 88.24,39.11 90.68,39.01 88.24,40.63 90.68,40.63 93.78,40.68 93.02,38.5 107.54,52.58 109.88,52.58 106.17,56.69 114,57.66 114.91,54.15 102.92,61.57 102.92,63.6 104.95,63.6 110.03,63.6 107.29,64.26 114.96,61.57 111.66,59.94 120.4,64.01 120.4,59.54 116.94,52.53 108.61,68.88 109.98,69.75 119.18,68.88 117.96,70.1 117.14,65.23 110.03,65.38 118.67,76.09 119.89,76.09 121.11,76.09 111.46,71.22 109.98,71.22 106.88,76.1 106.83,78.59 106.88,73.61 114.3,55.47 109.88,49.33 107.44,49.33
  pour Bottom (rank 2): 126.39,-1.63 126.39,80.56 90.22,80.56 -2.03,80.56 -2.03,-1.63
  pour Top (rank 2): 126.39,-1.63 126.39,80.56 90.22,80.56 -2.03,80.56 -2.03,-1.63
GND_ISO  (via drill 0.35)
  other vias: 68.48,56.69 72.75,78.03 78.23,78.03 71.12,64.21
  pour Top: 68.97,80.65 68.97,65.21 67.35,63.59 67.35,55.46 67.75,55.05 73.44,55.05 73.85,55.46 73.85,63.59 75.88,65.62 77.1,65.62 77.91,66.43 77.91,72.93 79.13,74.15 79.15,80.65
  pour Bottom: 68.97,80.65 68.97,65.21 67.35,63.59 67.35,55.46 67.75,55.05 73.44,55.05 73.85,55.46 73.85,63.59 75.88,65.62 77.1,65.62 77.91,66.43 77.91,72.93 79.13,74.15 79.16,80.65 79.13,80.65
I0  (1 unrouted)
I1  (1 unrouted)
I2  (1 unrouted)
I3  (1 unrouted)
I4  (1 unrouted)
I5  (1 unrouted)
I6  (1 unrouted)
I7  (1 unrouted)
I8  (1 unrouted)
I9  (1 unrouted)
LED_I0  (1 unrouted)
LED_I1  (1 unrouted)
LED_I2  (1 unrouted)
LED_I3  (1 unrouted)
LED_I4  (1 unrouted)
LED_I5  (1 unrouted)
LED_I6  (1 unrouted)
LED_I7  (1 unrouted)
LED_I8  (1 unrouted)
LED_I9  (1 unrouted)
LED_PWR  (1 unrouted)
N$1
  Top 0.305: R24.2 108.35,22.13 T10.1
N$2
  Top 0.406: IC6.6 68.85,61.68 68.16,62.37 68.16,63.18 70.68,65.7 CLKOUT.4
N$3
  Top 0.305: R20.2 75.76,21.83 T2.1
N$4  (via drill 0.35)
  Top 0.305: R32.1 74.57,17.36 v74.57,16.05
  Bottom 0.305: v74.57,16.05 81.28,16.05 82.7,14.63 87.34,14.63 LED0.C2
N$5
  Top 0.508: CLKOUT.1 77.71,75.17 76.29,73.75 76.29,66.84 73.04,63.59 73.04,59.93 72.22,59.12 71.41,59.12 | 71.41,59.12 70.62,59.12 IC6.8 | C26.1 72.16,57.55 71.41,58.3 71.41,59.12
N$6  (2 unrouted)
N$7
  Top 0.305: T10.3 107.7,18.69 108.35,18.04 R36.2
N$8
  Top 0.305: T2.3 75.11,18.69 75.76,18.04 R32.2
N$9  (2 unrouted)
N$10  (2 unrouted)
N$11  (2 unrouted)
N$12  (2 unrouted)
N$14
  Top 0.305: R26.2 79.83,21.83 T3.1
N$15
  Top 0.305: R22.2 92.02,21.83 T6.1
N$16
  Top 0.305: T3.3 79.18,18.69 79.83,18.04 R39.2
N$17
  Top 0.305: R21.2 83.89,21.83 T4.1
N$18
  Top 0.305: R42.1 102.91,16.16 103.83,15.24 103.83,9.05 LED3.C1
N$19
  Top 0.305: T4.3 83.24,18.69 83.89,18.04 R33.2
N$20
  Top 0.305: R27.2 87.95,21.83 T5.1
N$21
  Top 0.305: T6.3 91.37,18.69 92.02,18.04 R34.2
N$22
  Top 0.305: T5.3 87.31,18.69 87.95,18.04 R40.2
N$23  (via drill 0.35)
  Top 0.305: R35.1 98.85,16.35 v98.75,16.26
  Bottom 0.305: v98.75,16.26 103.43,16.26 104.04,15.65 104.04,13.93 LED3.C2
N$24
  Top 0.305: R28.2 96.08,21.83 T7.1
N$25
  Top 0.305: T7.3 95.43,18.69 96.08,18.04 R41.2
N$26
  Top 0.305: R23.2 100.15,21.83 T8.1
N$27
  Top 0.305: T8.3 99.5,18.69 100.15,18.04 R35.2
N$28
  Top 0.305: R29.2 104.21,21.83 T9.1
N$29
  Top 0.305: T9.3 103.56,18.69 104.21,18.04 R42.2
N$30  (via drill 0.35)
  Top 0.305: R33.1 82.7,17.36 v82.7,16.05
  Bottom 0.305: v82.7,16.05 83.31,15.44 92.66,15.44 93.47,14.63 93.47,13.83 LED1.C2
N$31  (via drill 0.35)
  Top 0.305: R34.1 90.72,16.35 v90.63,16.26
  Bottom 0.305: v90.63,16.26 97.33,16.26 98.15,15.44 98.15,14.49 LED2.C2
N$32
  Top 0.305: R40.1 86.66,16.16 87.38,15.44 92.25,15.44 93.07,14.63 93.07,9.16 LED1.C1
N$33
  Top 0.305: R41.1 94.78,16.16 95.3,15.65 97.54,15.65 98.35,14.83 98.35,9.2 LED2.C1
N$34
  Top 0.305: R30.2 112.41,22.13 T11.1
N$35  (via drill 0.35)  (11 unrouted)
  other vias: 38.91,37.59 38.91,42.88 38.91,32.21 50.19,24.99 55.27,24.99 65.13,33.63 65.13,38.61 65.13,43.79 49.07,50.9 55.37,51.1 56.69,51.1 50.9,51.51
N$36
  Top 0.305: R39.1 78.64,17.36 78.64,15.24 79.25,14.63 87.58,14.63 88.19,14.02 88.19,8.7 LED0.C1
N$38
  Top 0.305: C7.1 107.78,61.04 IC3.17
N$40
  Top 0.305: USB.P$2 113.79,72.69 113.79,70.71 114.34,70.17 IC2.P$1
N$41
  Top 0.508: CLKIN.1 90.51,75.16 90.51,65.21 89.7,64.4 87.97,64.4 87.38,63.8 87.38,62.96 R3.1 87.43,60.66 R2.2
N$42
  Top 0.508: IC5.5 88.89,57.63 arc-90 C24.1 89,57.54 89,58.52 88.19,59.33 86.56,59.33 86.1,59.79 R2.1
N$43
  Top 0.203: JP1.2 80.06,61.62 79.7,61.27 78.84,61.27 78.03,60.45 76.34,60.45 IC6.2
N$45  (1 unrouted)
N$46  (1 unrouted)
N$47
  Top 0.305: T11.3 111.76,18.69 112.41,18.04 R44.2
N$50
  Top 0.305: USB.P$3 112.98,70.71 112.44,70.17 IC2.P$3
N$53
  Top 0.305: R25.2 116.47,22.13 T12.1
N$54
  Top 0.305: T12.3 115.82,18.69 116.47,18.04 R37.2
N$56
  Top 0.305: R31.2 120.54,22.13 T13.1
N$59
  Top 0.508: C2.1 119.85,73.45 USB.SHIELD_4
N$60
  Top 0.305: T13.3 119.89,18.69 120.54,18.04 R45.2
N$61
  Top 0.508: R1.1 119.86,78.75 USB.SHIELD_1
N$62
  Top 0.305: R45.1 119.24,8.14 LED5.C1
N$63
  Top 0.305: R37.1 115.17,13.45 LED5.C2
N$65  (via drill 0.35)
  Top 0.305: R36.1 107.05,16.09 v107.09,16.05
  Bottom 0.305: v107.09,16.05 108.92,16.05 109.53,15.44 109.53,13.77 LED4.C2
N$66
  Top 0.305: R44.1 111.11,16.42 110.34,15.65 110.34,7.88 LED4.C1
OSC1
  Top 0.305: IC1.92 50.12,47.53 OSC.P$3
PDI_CLK
  Top 0.203: IC1.90 51.12,47.06 51.82,47.75 51.82,53.34 51.41,53.75 51.41,56.13 PDI.5
PDI_DATA
  Top 0.203: IC1.89 51.62,46.95 52.22,47.55 52.22,53.54 51.82,53.95 51.82,55.47 52.22,55.88 54.2,55.88 PDI.1
STATE  (1 unrouted)
USBDM
  Top 0.305: C6.1 117.04,66.65 114.2,66.65 114.2,66.05 IC2.P$6
  Top 0.406: IC3.16 112.39,61.69 arc90 114.3,63.6 114.3,65.88 arc-90 IC2.P$6
USBDP
  Top 0.305: C4.1 110.13,66.65 112.57,66.65 112.57,66.05 IC2.P$4
  Top 0.406: IC2.P$4 112.44,63.67 arc-90 111.11,62.34 IC3.15
USER_BUTTON_0  (3 unrouted)
USER_BUTTON_1  (3 unrouted)
VCC  (via drill 0.35)
  other vias: 118.67,50.6

### Text on the board
tPlace: harp input expander v1.0